# Altium schematic sheet KeyPadScanner.SchDoc
size B; Organization: Altium Limited; Address1: L3, 12a Rodborough Rd; Address2: Frenchs Forest; Address3: NSW; Address4: Australia 2086
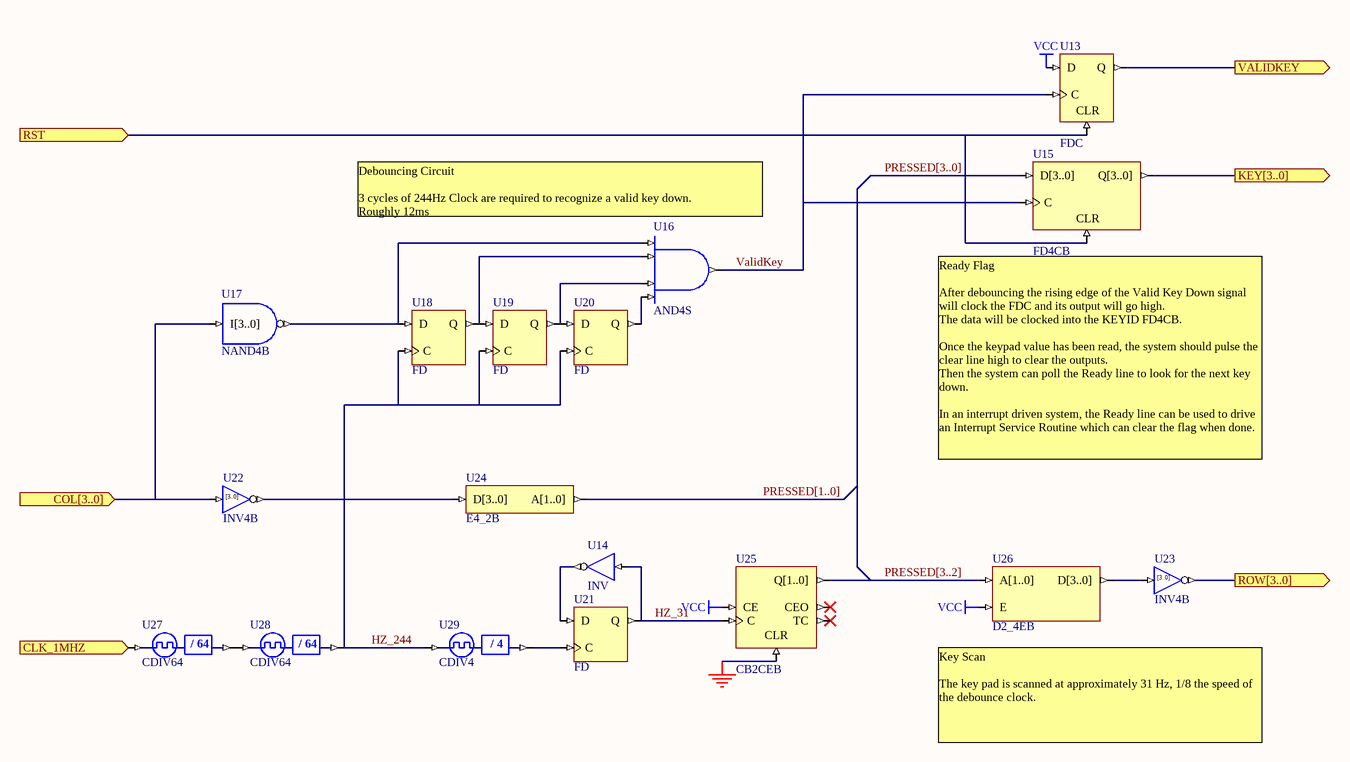
[diagram p0: KeyPadScanner.SchDoc]

## Parts
U13  FDC
U14  INV
U15  FD4CB
U16  AND4S
U17  NAND4B
U18  FD
U19  FD
U20  FD
U21  FD
U22  INV4B
U23  INV4B
U24  E4_2B
U25  CB2CEB
U26  D2_4EB
U27  CDIV64
U28  CDIV64
U29  CDIV4

## Ports
CLK_1MHZ (in), COL[3..0] (in), KEY[3..0] (out), ROW[3..0] (out), RST (in), VALIDKEY (out)

## Nets
GND: U25.CLR
VCC: U13.D U25.CE U26.E
CLK_1MHZ: U27.CLKIN ; port CLK_1MHZ
COL[3..0]: U17.I[3..0] U22.I[3..0] ; port COL[3..0]
HZ_31: U14.I U21.Q U25.C
HZ_244: U18.C U19.C U20.C U28.CLKDV U29.CLKIN
KEY[3..0]: U15.Q[3..0] ; port KEY[3..0]
PRESSED[1..0]: U24.A[1..0]
PRESSED[3..0]: U15.D[3..0]
PRESSED[3..2]: U25.Q[1..0] U26.A[1..0]
ROW[3..0]: U23.O[3..0] ; port ROW[3..0]
RST: U13.CLR U15.CLR ; port RST
ValidKey: U13.C U15.C U16.O
VALIDKEY: U13.Q ; port VALIDKEY  [a separate net that carries the same name]
NetU14_O: U14.O U21.D
NetU16_I0: U16.I0 U17.O U18.D
NetU16_I1: U16.I1 U18.Q U19.D
NetU16_I2: U16.I2 U19.Q U20.D
NetU16_I3: U16.I3 U20.Q
NetU21_C: U21.C U29.CLKDV
NetU22_O[3..0]: U22.O[3..0] U24.D[3..0]
NetU23_I[3..0]: U23.I[3..0] U26.D[3..0]
NetU27_CLKDV: U27.CLKDV U28.CLKIN

Not connected (* = marked no-connect by the designer): U25 CEO* TC*

## Buses and harness runs
bus PRESSED[1..0]
bus PRESSED[3..0]
bus PRESSED[3..2]

## Notes on the sheet
- (near U16) Debouncing Circuit
  3 cycles of 244Hz Clock are required to recognize a valid key down.
  Roughly 12ms
- (near U15) Ready Flag
  After debouncing the rising edge of the Valid Key Down signal will clock the FDC and its output will go high.
  The data will be clocked into the KEYID FD4CB.
  Once the keypad value has been read, the system should pulse the clear line high to clear the outputs.
  Then the system can poll the Ready line to look for the next key down.
  In an interrupt driven system, the Ready line can be used to drive an Interrupt Service Routine which can clear the flag when done.
- (near U26) Key Scan
  The key pad is scanned at approximately 31 Hz, 1/8 the speed of the debounce clock.
- Title
- Size:
- Date:
- B
- Number:
- Time:
- Revision:
- Sheet
- of
- File:
- (in symbol CDIV4) / 4
- (in symbol CDIV64) / 64
- (in symbol INV4B) [3..0]

## Library data of the parts
U13 = FDC: D-Type Flip-Flop with Asynchronous Clear; ArchiveName: GENERIC; Published: 18-Dec-2003; Publisher: Altium Limited; Xilinx Equivalent: FDC; Core Revision: 1.00.00
U14 = INV: Inverter; ArchiveName: GENERIC; Published: 18-Nov-2003; Publisher: Altium Limited; Xilinx Equivalent: INV; Core Revision: 1.00.00
U15 = FD4CB: 4-Bit D-Type Flip-Flop with Asynchronous Clear, Bus Version; ArchiveName: GENERIC; Published: 18-Dec-2003; Publisher: Altium Limited; Core Revision: 1.00.00
U16 = AND4S: 4-Input AND Gate, Single Pin Version; Xilinx Equivalent: AND4; ArchiveName: GENERIC; Published: 18-Nov-2003; Publisher: Altium Limited; Core Revision: 1.00.00
U17 = NAND4B: 4-Input NAND Gate, Bus Version; ArchiveName: GENERIC; Published: 18-Nov-2003; Publisher: Altium Limited; Core Revision: 1.00.00
U18-U21 = FD: D-Type Flip-Flop; ArchiveName: GENERIC; Published: 18-Nov-2003; Publisher: Altium Limited; Xilinx Equivalent: FD; Core Revision: 1.00.00
U22 U23 = INV4B: 4-Bit Inverter, Bus Version; ArchiveName: GENERIC; Published: 18-Nov-2003; Publisher: Altium Limited; Core Revision: 1.00.00
U24 = E4_2B: 4- to 2-Bit Priority Encoder, Bus Version; ArchiveName: GENERIC; Published: 18-Nov-2003; Publisher: Altium Limited; Core Revision: 1.00.00
U25 = CB2CEB: 2-Bit Cascadable Binary Counters with Clock Enable and Asynchronous Clear, Bus Version; ArchiveName: GENERIC; Published: 18-Dec-2003; Publisher: Altium Limited; Core Revision: 1.00.00
U26 = D2_4EB: Binary 2- to 4-Bit Decoder with Enable, Bus Version; ArchiveName: GENERIC; Published: 18-Nov-2003; Publisher: Altium Limited; Core Revision: 1.00.00
U27 U28 = CDIV64: Clock Divider by 64; ArchiveName: GENERIC; Published: 18-Nov-2003; Publisher: Altium Limited; Core Revision: 1.00.00
U29 = CDIV4: Clock Divider by 4; ArchiveName: GENERIC; Published: 18-Nov-2003; Publisher: Altium Limited; Core Revision: 1.00.00